# Altium schematic sheet J201M1_MOS_TEST.SchDoc
size A3; SheetNumber: 1; SheetTotal: 1
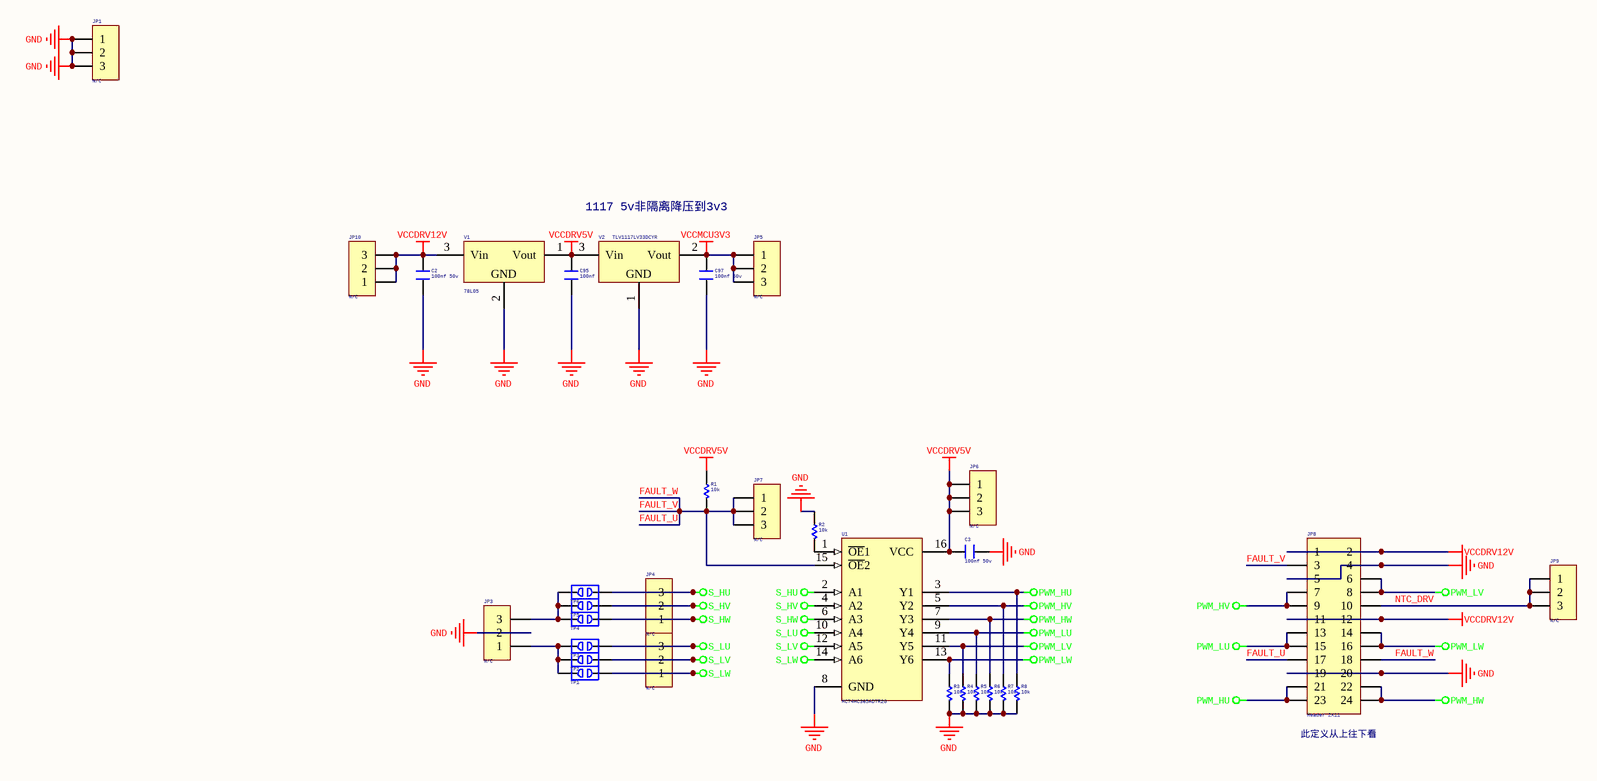
[diagram p0: J201M1_MOS_TEST.SchDoc]

## Parts
C2  100nf 50v  [C 0603]
C3  100nf 50v  [C 0603]
C95  100nf 50v  [C 0603]
C97  100nf 50v  [C 0603]
JP1  N/C  [HDR-1X3]
JP2  N/C  [HDR-1X3]
JP3  N/C  [HDR-1X3]
JP4  N/C  [HDR-1X3]
JP5  N/C  [HDR-1X3]
JP6  N/C  [HDR-1X3]
JP7  N/C  [HDR-1X3]
JP8  Header 2X11  [HDR-12X2]
JP9  N/C  [HDR-1X3]
JP10  N/C  [HDR-1X3]
R1  10k  [R 0805]
R2  10k  [R 0805]
R3  10k  [R 0805]
R4  10k  [R 0805]
R5  10k  [R 0805]
R6  10k  [R 0805]
R7  10k  [R 0805]
R8  10k  [R 0805]
TP1  DEBUG PAD  [DEBUG PAD 0603]  (value not drawn)
TP2  DEBUG PAD  [DEBUG PAD 0603]  (value not drawn)
TP3  DEBUG PAD  [DEBUG PAD 0603]  (value not drawn)
TP4  DEBUG PAD  [DEBUG PAD 0603]  (value not drawn)
TP5  DEBUG PAD  [DEBUG PAD 0603]  (value not drawn)
TP6  DEBUG PAD  [DEBUG PAD 0603]  (value not drawn)
U1  MC74HC365ADTR2G  [TSSOP16_L]
V1  78L05  [SOT89_M]
V2  TLV1117LV33DCYR  [SOT223_L]

## Nets
GND: C2.2 C3.2 C95.2 C97.2 JP1.1 JP1.2 JP1.3 JP3.2 JP8.4 JP8.5 JP8.19 JP8.20 R2.1 R3.2 R4.2 R5.2 R6.2 R7.2 R8.2 U1.8(GND) V1.2(GND) V2.1(GND)
PWM_HU: JP8.21 JP8.23 R8.1 U1.3(Y1)
PWM_HV: JP8.7 JP8.9 R7.1 U1.5(Y2)
PWM_HW: JP8.22 JP8.24 R6.1 U1.7(Y3)
PWM_LU: JP8.13 JP8.15 R5.1 U1.9(Y4)
PWM_LV: JP8.6 JP8.8 R4.1 U1.11(Y5)
PWM_LW: JP8.14 JP8.16 R3.1 U1.13(Y6)
S_HU: JP4.3 TP6.1 U1.2(A1)
S_HV: JP4.2 TP5.1 U1.4(A2)
S_HW: JP4.1 TP4.1 U1.6(A3)
S_LU: JP2.3 TP3.1 U1.10(A4)
S_LV: JP2.2 TP2.1 U1.12(A5)
S_LW: JP2.1 TP1.1 U1.14(A6)
VCCDRV5V: C3.1 C95.1 JP6.1 JP6.2 JP6.3 R1.1 U1.16(VCC) V1.1(Vout) V2.3(Vin)
VCCDRV12V: C2.1 JP8.1 JP8.2 JP8.11 JP8.12 JP10.1 JP10.2 JP10.3 V1.3(Vin)
VCCMCU3V3: C97.1 JP5.1 JP5.2 JP5.3 V2.2(Vout)
FAULT_U: JP7.1 JP7.2 JP7.3 JP8.3 JP8.17 JP8.18 R1.2 U1.15(~{OE}2)  [also labelled FAULT_V, FAULT_W]
NTC_DRV: JP8.10 JP9.1 JP9.2 JP9.3
NetJP3_1: JP3.1 TP1.2 TP2.2 TP3.2
NetJP3_3: JP3.3 TP4.2 TP5.2 TP6.2
NetR2_2: R2.2 U1.1(~{OE}1)

## Notes on the sheet
- 1117 5v非隔离降压到3v3
- (near JP8) 此定义从上往下看

## Library data of the parts
C2 C3 C95 C97 = C: 无极性贴片电容; Voltage: 50v; Value: 100nf
JP1-JP7 JP9 JP10 = Header 3: 3P接插件
JP8 = Header 12X2: 12*2P接插件
R1-R8 = R: 贴片电阻; Value: 10k
TP1-TP6 = DEBUG: 调试断点焊盘
U1 = SN74HC365D: 6路缓冲器
V1 = 78LXX: SOT89线性稳压芯片
V2 = AMS1117: 三端稳压芯片